# Altium schematic sheet FPGA.SchDoc
size A
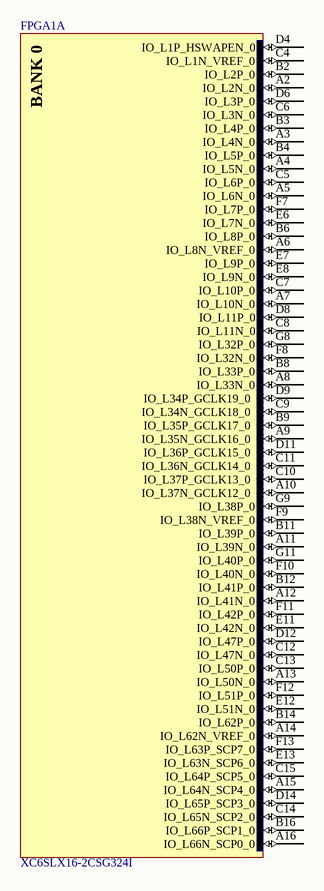
[diagram p0: FPGA.SchDoc]

## Parts
FPGA1  XC6SLX16-2CSG324I  [CSG324]  (part A of 7)

## Nets

Not connected (* = marked no-connect by the designer): FPGA1 A2(IO_L2N_0) A3(IO_L4N_0) A4(IO_L5N_0) A5(IO_L6N_0) A6(IO_L8N_VREF_0) A7(IO_L10N_0) A8(IO_L33N_0) A9(IO_L35N_GCLK16_0) A10(IO_L37N_GCLK12_0) A11(IO_L39N_0) A12(IO_L41N_0) A13(IO_L50N_0) A14(IO_L62N_VREF_0) A15(IO_L64N_SCP4_0) A16(IO_L66N_SCP0_0) B2(IO_L2P_0) B3(IO_L4P_0) B4(IO_L5P_0) B6(IO_L8P_0) B8(IO_L33P_0) B9(IO_L35P_GCLK17_0) B11(IO_L39P_0) B12(IO_L41P_0) B14(IO_L62P_0) B16(IO_L66P_SCP1_0) C4(IO_L1N_VREF_0) C5(IO_L6P_0) C6(IO_L3N_0) C7(IO_L10P_0) C8(IO_L11N_0) C9(IO_L34N_GCLK18_0) C10(IO_L37P_GCLK13_0) C11(IO_L36N_GCLK14_0) C12(IO_L47N_0) C13(IO_L50P_0) C14(IO_L65N_SCP2_0) C15(IO_L64P_SCP5_0) D4(IO_L1P_HSWAPEN_0) D6(IO_L3P_0) D8(IO_L11P_0) D9(IO_L34P_GCLK19_0) D11(IO_L36P_GCLK15_0) D12(IO_L47P_0) D14(IO_L65P_SCP3_0) E6(IO_L7N_0) E7(IO_L9P_0) E8(IO_L9N_0) E11(IO_L42N_0) E12(IO_L51N_0) E13(IO_L63N_SCP6_0) F7(IO_L7P_0) F8(IO_L32N_0) F9(IO_L38N_VREF_0) F10(IO_L40N_0) F11(IO_L42P_0) F12(IO_L51P_0) F13(IO_L63P_SCP7_0) G8(IO_L32P_0) G9(IO_L38P_0) G11(IO_L40P_0)

## Notes on the sheet
- (in symbol CMP-0067-00414-1, part A) BANK 0

## Library data of the parts
FPGA1 = CMP-0067-00414-1: Spartan-6 LX 1.2V FPGA, 232 User I/Os, 324-Ball Chip-Scale BGA (0.8mm Pitch), Speed Grade 2, Industrial Grade, Pb-Free; PackageVersion: ver1.1, Nov-2009; DatasheetVersion: ver1.6, Nov-2010; Code_JEDEC: MO-275-KKAC-1; PackageReference: CSG324; PackageDescription: 324-Ball Chip-Scale BGA (CSG324) Package, 0.8 mm Pitch